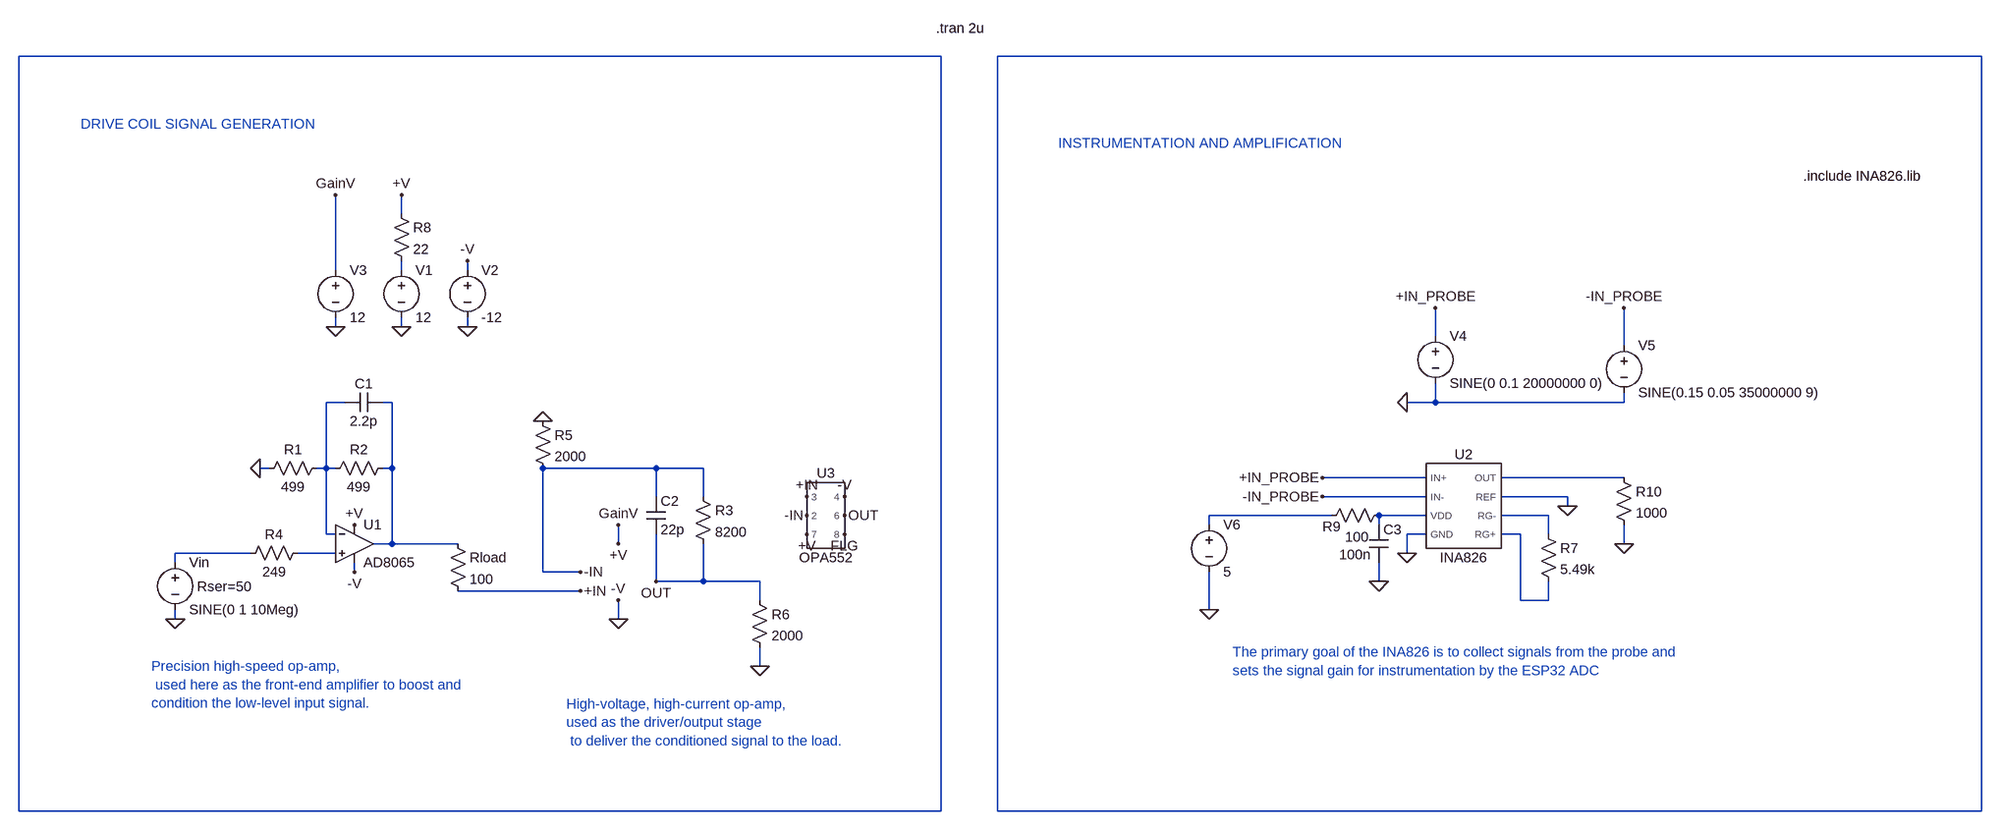
[diagram p0: schematic InstrumentationAmplification.asc]
InstrumentationAmplification.asc, the LTspice schematic file:
Version 4.1
SHEET 1 4388 700
WIRE 2240 -2016 0 -2016
WIRE 4384 -2016 2336 -2016
WIRE 656 -1664 656 -1696
WIRE 544 -1568 544 -1696
WIRE 656 -1568 656 -1584
WIRE 768 -1568 768 -1584
WIRE 544 -1472 544 -1488
WIRE 656 -1472 656 -1488
WIRE 768 -1472 768 -1488
WIRE 3184 -1456 3184 -1504
WIRE 3504 -1440 3504 -1504
WIRE 560 -1344 528 -1344
WIRE 640 -1344 624 -1344
WIRE 3184 -1344 3184 -1376
WIRE 3184 -1344 3136 -1344
WIRE 3504 -1344 3504 -1360
WIRE 3504 -1344 3184 -1344
WIRE 432 -1232 416 -1232
WIRE 528 -1232 528 -1344
WIRE 528 -1232 512 -1232
WIRE 544 -1232 528 -1232
WIRE 640 -1232 640 -1344
WIRE 640 -1232 624 -1232
WIRE 1088 -1232 896 -1232
WIRE 1168 -1232 1088 -1232
WIRE 3168 -1216 2992 -1216
WIRE 3504 -1216 3296 -1216
WIRE 1088 -1184 1088 -1232
WIRE 1168 -1184 1168 -1232
WIRE 3168 -1184 2992 -1184
WIRE 3408 -1184 3296 -1184
WIRE 3408 -1168 3408 -1184
WIRE 3008 -1152 2800 -1152
WIRE 3168 -1152 3088 -1152
WIRE 3376 -1152 3296 -1152
WIRE 2800 -1136 2800 -1152
WIRE 3088 -1136 3088 -1152
WIRE 528 -1120 528 -1232
WIRE 544 -1120 528 -1120
WIRE 3168 -1120 3136 -1120
WIRE 3328 -1120 3296 -1120
WIRE 3376 -1120 3376 -1152
WIRE 640 -1104 640 -1232
WIRE 640 -1104 608 -1104
WIRE 752 -1104 640 -1104
WIRE 1024 -1104 1024 -1136
WIRE 3504 -1104 3504 -1136
WIRE 400 -1088 272 -1088
WIRE 544 -1088 480 -1088
WIRE 3136 -1088 3136 -1120
WIRE 272 -1072 272 -1088
WIRE 576 -1056 576 -1072
WIRE 896 -1056 896 -1232
WIRE 960 -1056 896 -1056
WIRE 1088 -1040 1088 -1120
WIRE 1168 -1040 1168 -1104
WIRE 1168 -1040 1088 -1040
WIRE 1264 -1040 1168 -1040
WIRE 3088 -1040 3088 -1072
WIRE 960 -1024 752 -1024
WIRE 1264 -1008 1264 -1040
WIRE 3328 -1008 3328 -1120
WIRE 3376 -1008 3376 -1040
WIRE 3376 -1008 3328 -1008
WIRE 2800 -992 2800 -1056
WIRE 272 -976 272 -992
WIRE 1024 -976 1024 -1008
WIRE 1264 -896 1264 -928
WIRE 0 -560 0 -2016
WIRE 2240 -560 2240 -2016
WIRE 2240 -560 0 -560
WIRE 2336 -560 2336 -2016
WIRE 4384 -560 4384 -2016
WIRE 4384 -560 2336 -560
FLAG 656 -1696 +V
FLAG 272 -976 0
FLAG 576 -1136 +V
FLAG 768 -1584 -V
FLAG 576 -1056 -V
FLAG 416 -1232 0
FLAG 768 -1472 0
FLAG 656 -1472 0
FLAG 544 -1696 GainV
FLAG 544 -1472 0
FLAG 1024 -1136 GainV
FLAG 896 -1312 0
FLAG 1264 -896 0
FLAG 1344 -1184 +IN
FLAG 1344 -1152 -IN
FLAG 1344 -1120 +V
FLAG 1408 -1184 -V
FLAG 1408 -1152 OUT
FLAG 1408 -1120 FLG
FLAG 960 -1024 +IN
FLAG 960 -1056 -IN
FLAG 1024 -1104 +V
FLAG 1024 -1008 -V
FLAG 1024 -976 0
FLAG 1088 -1040 OUT
FLAG 3408 -1168 0
FLAG 3136 -1088 0
FLAG 3136 -1344 0
FLAG 3184 -1504 +IN_PROBE
FLAG 3504 -1504 -IN_PROBE
FLAG 2992 -1216 +IN_PROBE
FLAG 2992 -1184 -IN_PROBE
FLAG 3088 -1040 0
FLAG 3504 -1104 0
FLAG 2800 -992 0
SYMBOL voltage 656 -1584 R0
WINDOW 123 0 0 Left 2
WINDOW 39 0 0 Left 2
SYMATTR InstName V1
SYMATTR Value 12
SYMBOL voltage 272 -1088 R0
WINDOW 123 24 138 Left 2
WINDOW 39 37 57 Left 2
SYMATTR SpiceLine Rser=50
SYMATTR InstName Vin
SYMATTR Value SINE(0 1 10Meg)
SYMBOL res 528 -1248 R90
WINDOW 0 0 56 VBottom 2
WINDOW 3 32 56 VTop 2
SYMATTR InstName R1
SYMATTR Value 499
SYMBOL res 640 -1248 R90
WINDOW 0 0 56 VBottom 2
WINDOW 3 32 56 VTop 2
SYMATTR InstName R2
SYMATTR Value 499
SYMBOL Opamps\\AD8065 576 -1168 R0
SYMATTR InstName U1
SYMBOL voltage 768 -1584 R0
WINDOW 123 24 146 Left 2
WINDOW 39 24 125 Left 2
SYMATTR InstName V2
SYMATTR Value -12
SYMBOL res 736 -1120 R0
SYMATTR InstName Rload
SYMATTR Value 100
SYMBOL res 496 -1104 R90
WINDOW 0 0 56 VBottom 2
WINDOW 3 32 56 VTop 2
SYMATTR InstName R4
SYMATTR Value 249
SYMBOL cap 624 -1360 R90
WINDOW 0 0 32 VBottom 2
WINDOW 3 32 32 VTop 2
SYMATTR InstName C1
SYMATTR Value 2.2p
SYMBOL voltage 544 -1584 R0
WINDOW 123 0 0 Left 2
WINDOW 39 0 0 Left 2
SYMATTR InstName V3
SYMATTR Value 12
SYMBOL res 1152 -1200 R0
SYMATTR InstName R3
SYMATTR Value 8200
SYMBOL res 880 -1328 R0
SYMATTR InstName R5
SYMATTR Value 2000
SYMBOL cap 1072 -1184 R0
SYMATTR InstName C2
SYMATTR Value 22p
SYMBOL res 1248 -1024 R0
SYMATTR InstName R6
SYMATTR Value 2000
SYMBOL OPA552 1376 -1152 R0
SYMATTR InstName U3
SYMBOL res 640 -1680 R0
SYMATTR InstName R8
SYMATTR Value 22
SYMBOL INA826 3232 -1168 R0
SYMATTR InstName U2
SYMBOL res 3360 -1136 R0
SYMATTR InstName R7
SYMATTR Value 5.49k
SYMBOL voltage 3184 -1472 R0
WINDOW 123 0 0 Left 0
WINDOW 39 0 0 Left 0
SYMATTR InstName V4
SYMATTR Value SINE(0 0.1 20000000 0)
SYMBOL voltage 3504 -1456 R0
WINDOW 123 0 0 Left 0
WINDOW 39 0 0 Left 0
SYMATTR InstName V5
SYMATTR Value SINE(0.15 0.05 35000000 9)
SYMBOL cap 3072 -1136 R0
WINDOW 3 -51 51 Left 2
SYMATTR InstName C3
SYMATTR Value 100n
SYMBOL res 3104 -1168 R90
WINDOW 0 51 96 VBottom 2
WINDOW 3 37 53 VTop 2
SYMATTR InstName R9
SYMATTR Value 100
SYMBOL res 3488 -1232 R0
SYMATTR InstName R10
SYMATTR Value 1000
SYMBOL voltage 2800 -1152 R0
WINDOW 123 0 0 Left 0
WINDOW 39 0 0 Left 0
SYMATTR InstName V6
SYMATTR Value 5
TEXT 232 -896 Left 2 ;Precision high-speed op-amp,\n used here as the front-end amplifier to boost and \ncondition the low-level input signal.
TEXT 936 -832 Left 2 ;High-voltage, high-current op-amp, \nused as the driver/output stage\n to deliver the conditioned signal to the load.
TEXT 2544 -1784 Left 2 ;INSTRUMENTATION AND AMPLIFICATION
TEXT 3808 -1728 Left 2 !.include INA826.lib
TEXT 112 -1816 Left 2 ;DRIVE COIL SIGNAL GENERATION
TEXT 2232 -2064 Left 2 !.tran 2u
TEXT 2840 -920 Left 2 ;The primary goal of the INA826 is to collect signals from the probe and \nsets the signal gain for instrumentation by the ESP32 ADC

The netlist it stands for:
* InstrumentationAmplification.asc
V1 N003 0 12
Vin N011 0 SINE(0 1 10Meg) Rser=50
R1 N004 0 499
R2 N005 N004 499
X§U1 N012 N004 GainV 0 N005 AD8065  ; pins In+ In- V+ V- OUT
V2 0 0 -12
Rload N005 +IN 100
R4 N012 N011 249
C1 N005 N004 2.2p
V3 GainV 0 12
R3 -IN OUT 8200
R5 0 -IN 2000
C2 -IN OUT 22p
R6 OUT 0 2000
X§U3 +IN -IN GainV 0 OUT FLG OPA552  ; pins 3 2 7 4 6 8
R8 GainV N003 22
X§U2 +IN_PROBE -IN_PROBE N008 0 N006 0 N009 N010 INA826  ; pins IN+ IN- VDD GND OUT REF RG- RG+
R7 N009 N010 5.49k
V4 +IN_PROBE 0 SINE(0 0.1 20000000 0)
V5 -IN_PROBE 0 SINE(0.15 0.05 35000000 9)
C3 N008 0 100n
R9 N008 N007 100
R10 N006 0 1000
V6 N007 0 5
* Precision high-speed op-amp,
*  used here as the front-end amplifier to boost and
* condition the low-level input signal.
* High-voltage, high-current op-amp,
* used as the driver/output stage
*  to deliver the conditioned signal to the load.
* INSTRUMENTATION AND AMPLIFICATION
.include INA826.lib
* DRIVE COIL SIGNAL GENERATION
.tran 2u
* The primary goal of the INA826 is to collect signals from the probe and
* sets the signal gain for instrumentation by the ESP32 ADC
.lib C:\users\mmms\Documents\PCB\ECTdevice\spice\OPA552.LIB
.lib C:\users\mmms\Documents\PCB\ECTdevice\spice\INA826.lib
.backanno
.end